# EAGLE design OPEnS-RTC-1.0 (EAGLE 9.4.2)

## Sheet 1 of 3
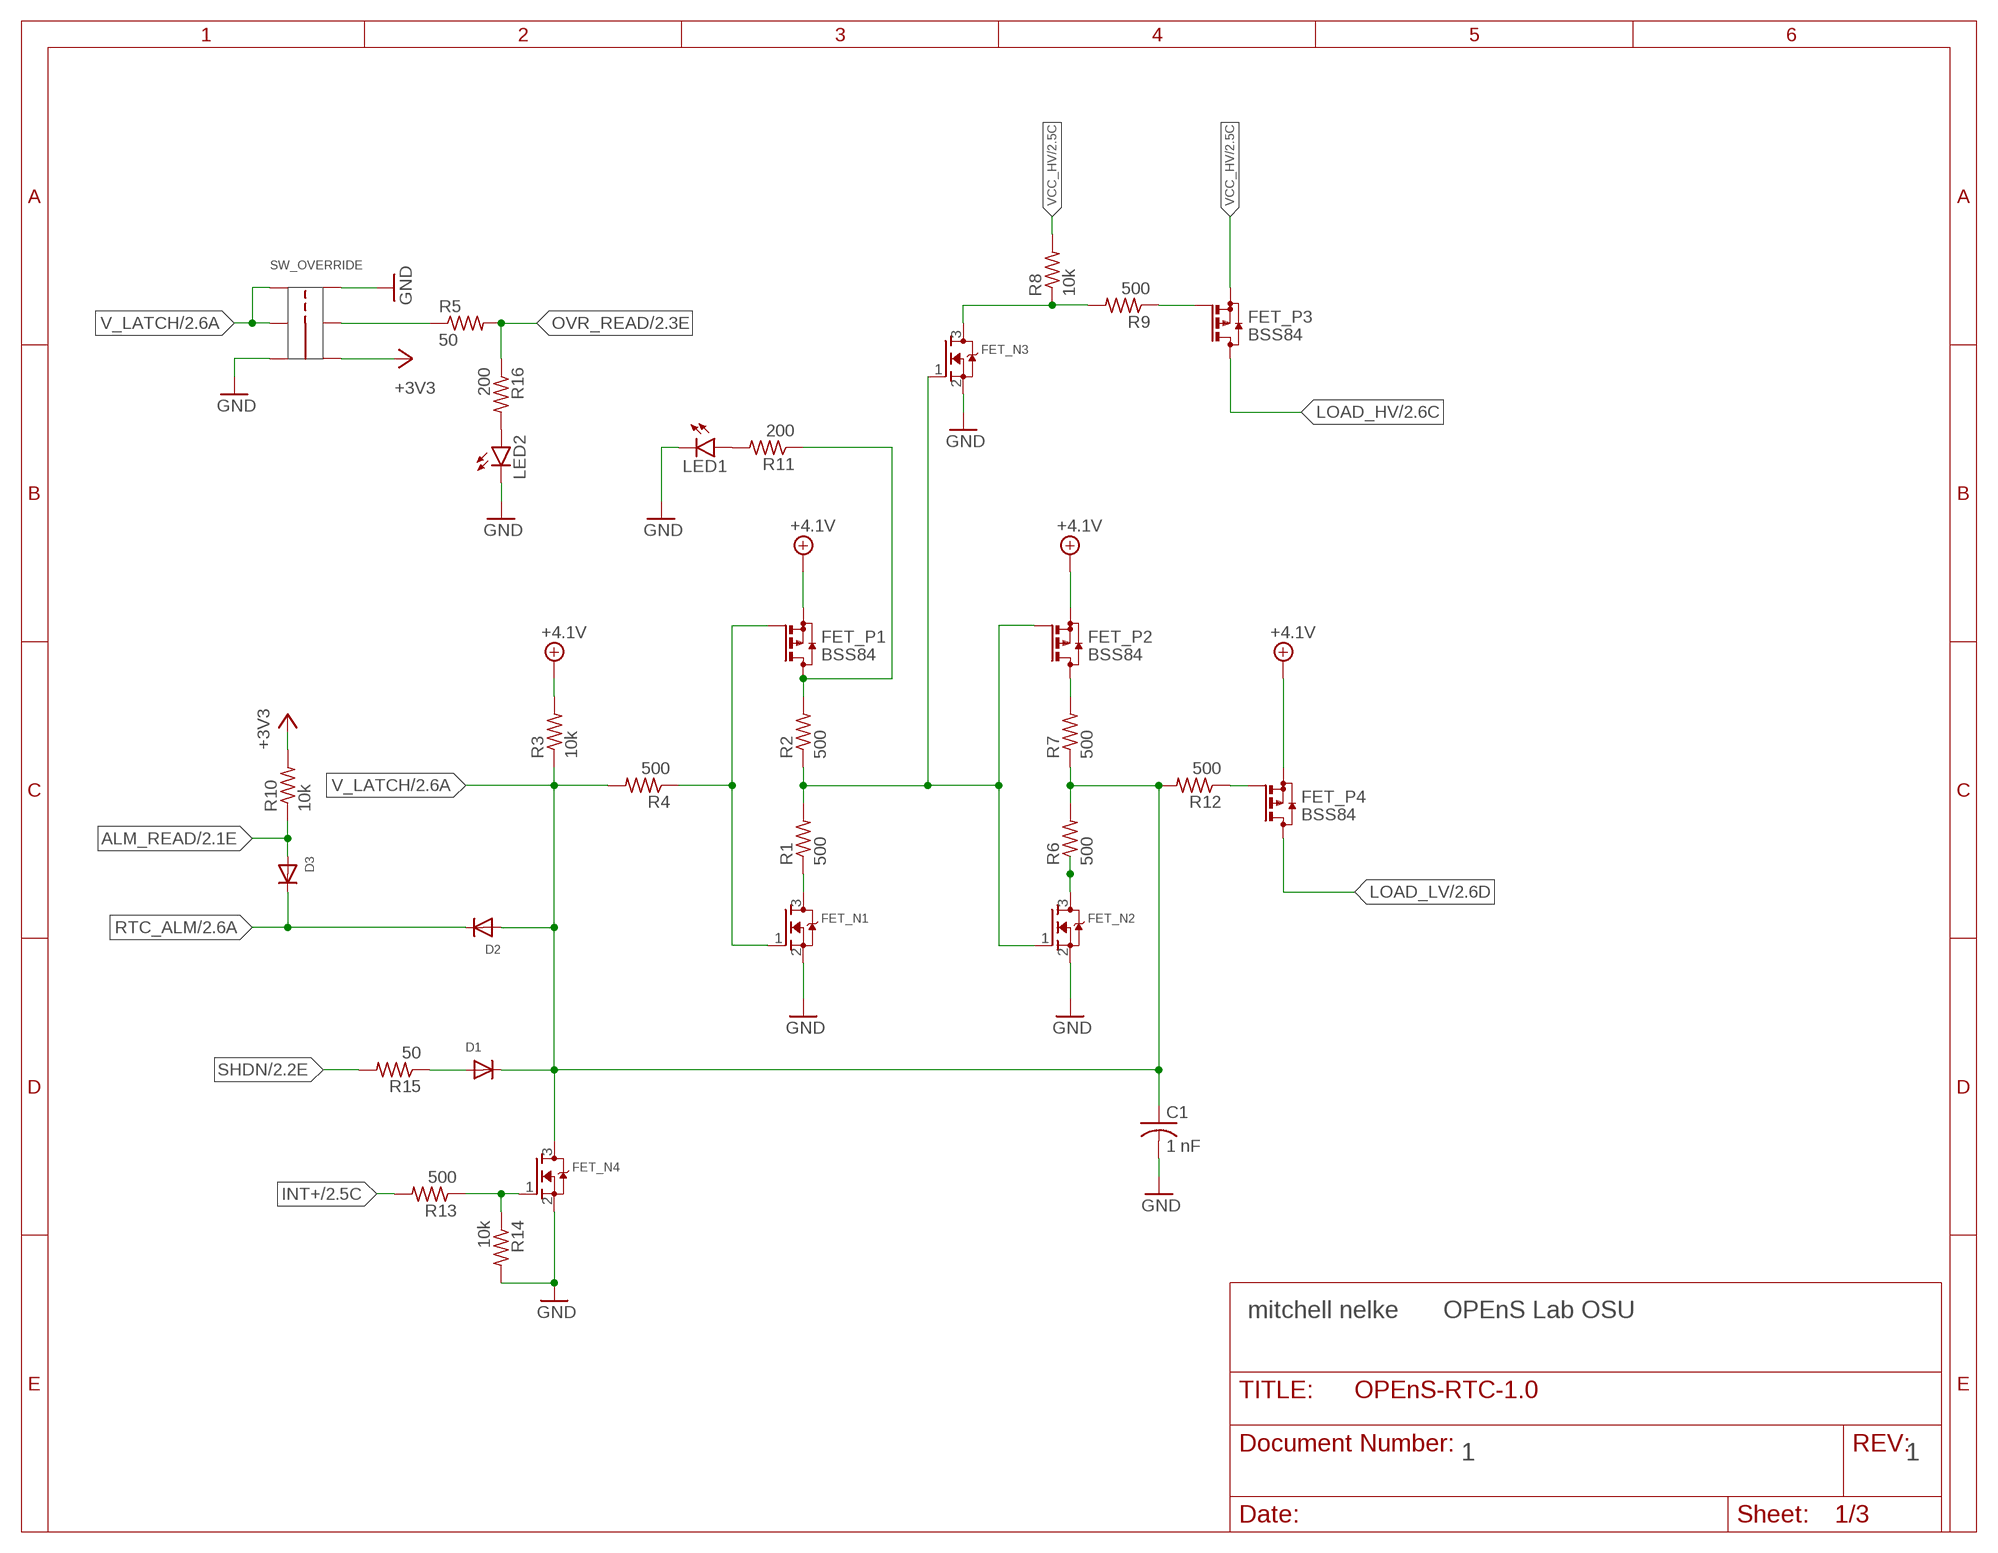
[diagram p0: schematic, sheet 1]

### Parts
C1  1 nF  C-USC0805  [C0805]
D1  DIODESOD-123  [SOD-123]
D2  DIODESOD-123  [SOD-123]
D3  DIODESOD-123  [SOD-123]
FET_N1  MOSFET-NREFLOW  [SOT23]
FET_N2  MOSFET-NREFLOW  [SOT23]
FET_N3  MOSFET-NREFLOW  [SOT23]
FET_N4  MOSFET-NREFLOW  [SOT23]
FET_P1  BSS84  [SOT23]
FET_P2  BSS84  [SOT23]
FET_P3  BSS84  [SOT23]
FET_P4  BSS84  [SOT23]
LED1  LEDSMT1206  [1206]
LED2  LEDSMT1206  [1206]
R1  500  R-US_R0805  [R0805]
R2  500  R-US_R0805  [R0805]
R3  10k  R-US_R0805  [R0805]
R4  500  R-US_R0805  [R0805]
R5  50  R-US_R0805  [R0805]
R6  500  R-US_R0805  [R0805]
R7  500  R-US_R0805  [R0805]
R8  10k  R-US_R0805  [R0805]
R9  500  R-US_R0805  [R0805]
R10  10k  R-US_R0805  [R0805]
R11  200  R-US_R0805  [R0805]
R12  500  R-US_R0805  [R0805]
R13  500  R-US_R0805  [R0805]
R14  10k  R-US_R0805  [R0805]
R15  50  R-US_R0805  [R0805]
R16  200  R-US_R0805  [R0805]
SW_OVERRIDE  JS202011JCQN  [VERTICAL_MNT_SMT-J]

### Nets
+3V3: R10.2 SW_OVERRIDE.A_ ; also sheet 2
+4.1V: FET_P1.2(S) FET_P2.2(S) FET_P4.2(S) R3.2 ; also sheet 2
ALM_READ: D3.A R10.1 ; also sheet 2
GND: C1.2 FET_N1.2(S) FET_N2.2(S) FET_N3.2(S) FET_N4.2(S) LED1.C LED2.C R14.2 SW_OVERRIDE.A SW_OVERRIDE.B_ ; also sheet 2
INT+: R13.2 ; also sheet 2
LOAD_HV: FET_P3.3(D) ; also sheet 2
LOAD_LV: FET_P4.3(D) ; also sheet 2
N$1: FET_P1.3(D) R2.2 R11.1
N$2: FET_N1.3(D) R1.1
N$3: FET_N1.1(G) FET_P1.1(G) R4.1
N$4: FET_N2.1(G) FET_N3.1(G) FET_P2.1(G) R1.2 R2.1
N$5: FET_N3.3(D) R8.1 R9.2
N$6: FET_P2.3(D) R7.2
N$7: FET_N2.3(D) R6.1
N$8: FET_P3.1(G) R9.1
N$9: LED1.A R11.2
N$10: FET_P4.1(G) R12.1
N$11: D1.A R15.1
N$12: FET_N4.1(G) R13.1 R14.1
N$13: LED2.A R16.2
N$16: R5.1 SW_OVERRIDE.COM_
OVR_READ: R5.2 R16.1 ; also sheet 2
RTC_ALM: D2.C D3.C ; also sheet 2
SHDN: R15.2 ; also sheet 2
V_LATCH: C1.1 D1.C D2.A FET_N4.3(D) R3.1 R4.2 R6.2 R7.1 R12.2 SW_OVERRIDE.B SW_OVERRIDE.COM ; also sheet 2
VCC_HV: FET_P3.2(S) R8.2 ; also sheet 2

### Notes on the sheet
- mitchell nelke | OPEnS Lab OSU
- 1 | 1

## Sheet 2 of 3
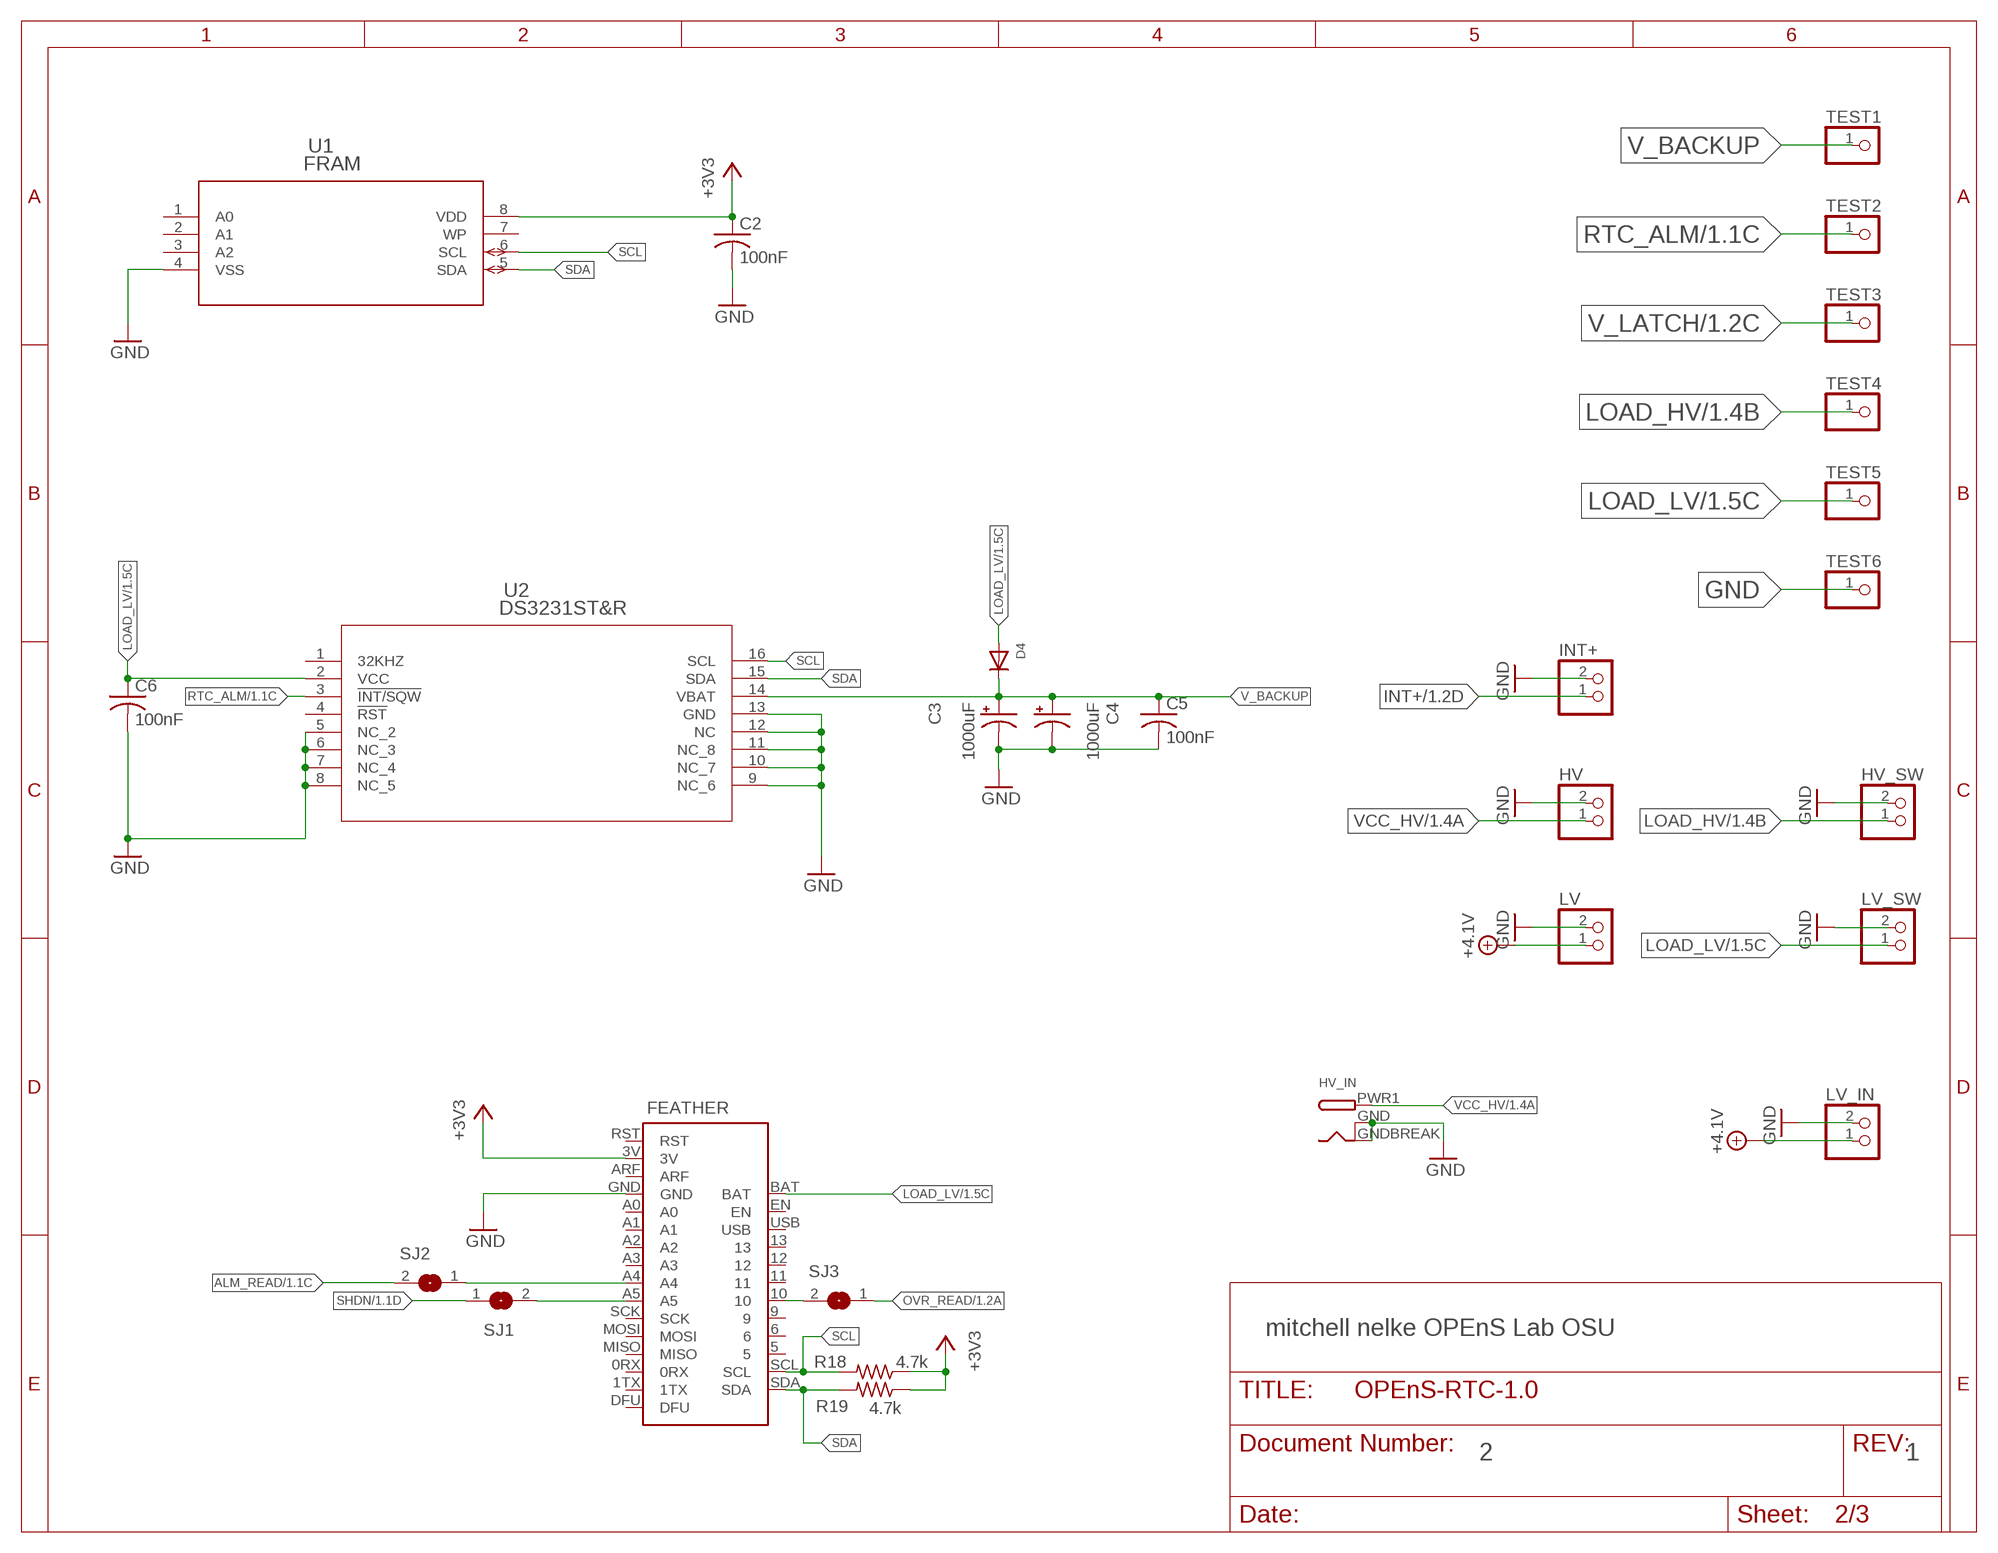
[diagram p1: schematic, sheet 2]

### Parts
C2  100nF  C-USC0805  [C0805]
C3  1000uF  CPOL-USE3.5-8  [E3,5-8]
C4  1000uF  CPOL-USE3.5-8  [E3,5-8]
C5  100nF  C-USC0805  [C0805]
C6  100nF  C-USC0805  [C0805]
D4  DIODESOD-123  [SOD-123]
FEATHER  BLUEFRUIT_M0  [BLUEFRUIT_MO]
HV  JST_2PIN-SMT  [JST-PH-2-SMT]
HV_IN  DCBARRELSMT  [DCJACK_2MM_SMT]
HV_SW  JST_2PIN-SMT  [JST-PH-2-SMT]
INT+  JST_2PIN-SMT  [JST-PH-2-SMT]
LV  JST_2PIN-SMT  [JST-PH-2-SMT]
LV_IN  JST_2PIN-SMT  [JST-PH-2-SMT]
LV_SW  JST_2PIN-SMT  [JST-PH-2-SMT]
R18  4.7k  R-US_M0805  [M0805]
R19  4.7k  R-US_M0805  [M0805]
SJ1  SJ  [SJ]
SJ2  SJ  [SJ]
SJ3  SJ  [SJ]
TEST1  PINHD-1X1  [1X01]
TEST2  PINHD-1X1  [1X01]
TEST3  PINHD-1X1  [1X01]
TEST4  PINHD-1X1  [1X01]
TEST5  PINHD-1X1  [1X01]
TEST6  PINHD-1X1  [1X01]
U1  FRAM  [FPT-8P-M02]
U2  DS3231ST&R  [21-0042B_16]

### Nets
+3V3: C2.1 FEATHER.3V R18.1 R19.1 U1.8(VDD) ; also sheet 1
+4.1V: LV.1 LV_IN.1 ; also sheet 1
ALM_READ: SJ2.2 ; also sheet 1
GND: C2.2 C3.- C4.- C5.2 C6.2 FEATHER.GND HV.2 HV_IN.GND(GNDBREAK) HV_IN.GNDBREAK(GND) HV_SW.2 INT+.2 LV.2 LV_IN.2 LV_SW.2 TEST6.1 U1.4(VSS) U2.5(NC_2) U2.6(NC_3) U2.7(NC_4) U2.8(NC_5) U2.9(NC_6) U2.10(NC_7) U2.11(NC_8) U2.12(NC) U2.13(GND) ; also sheet 1
INT+: INT+.1 ; also sheet 1
LOAD_HV: HV_SW.1 TEST4.1 ; also sheet 1
LOAD_LV: C6.1 D4.A FEATHER.BAT LV_SW.1 TEST5.1 U2.2(VCC) ; also sheet 1
N$14: FEATHER.A4 SJ2.1
N$15: FEATHER.A5 SJ1.2
N$20: FEATHER.10 SJ3.2
OVR_READ: SJ3.1 ; also sheet 1
RTC_ALM: TEST2.1 U2.3(!INT/SQW) ; also sheet 1
SCL: FEATHER.SCL R18.2 U1.6(SCL) U2.16(SCL)
SDA: FEATHER.SDA R19.2 U1.5(SDA) U2.15(SDA)
SHDN: SJ1.1 ; also sheet 1
V_BACKUP: C3.+ C4.+ C5.1 D4.C TEST1.1 U2.14(VBAT)
V_LATCH: TEST3.1 ; also sheet 1
VCC_HV: HV.1 HV_IN.PWR1(PWR) ; also sheet 1
Unconnected: FEATHER.0RX FEATHER.1TX FEATHER.5 FEATHER.6 FEATHER.9 FEATHER.11 FEATHER.12 FEATHER.13 FEATHER.A0 FEATHER.A1 FEATHER.A2 FEATHER.A3 FEATHER.ARF FEATHER.DFU FEATHER.EN FEATHER.MISO FEATHER.MOSI FEATHER.RST FEATHER.SCK FEATHER.USB U1.1(A0) U1.2(A1) U1.3(A2) U1.7(WP) U2.1(32KHZ) U2.4(!RST)

### Notes on the sheet
- mitchell nelke OPEnS Lab OSU
- 2 | 1

## Sheet 3 of 3

## Library data of the parts
C1 = rcl:C-US: CAPACITOR, American symbol; SPICEPREFIX: C
C2 C5 C6 = adafruit:C-US: CAPACITOR, American symbol
C3 C4 = adafruit:CPOL-US: POLARIZED CAPACITOR, American symbol
D1-D4 = adafruit:DIODE: Diode SMADIODE - SMA Surface Mount Package 20V 1A Schottky Diode Digikey: 641-1014-6-ND DO-1N4148 - Through Hole Small Current Diode SOD-123 20V 1 A (.5mV Vf) Schottky Diode - Digikey: MBRX120TPMSCT-ND SOD-323 10V 570mA (.38mV Vf, 3ns) Schottky Diode - Digikey: ZLLS410CT-ND SOD-523 30V 30mA Schottky Diode (RB751S-40TE61) - Digikey: RB751S-40TE61CT-ND SOT23-R/W - SOT23 Package (R = Solder Paste/Reflow Ovens, W = Hand-Soldering) BAT54Film 40V 300mA - Digikey: 497-7162-1-ND
FEATHER = bluefruit_m0:BLUEFRUIT_M0: Adafruit's M0 Bluefruit / Bluetooth board layout
FET_N1-FET_N4 = adafruit:MOSFET-N: N-Channel Mosfet 2N7002E - 60V 260mA SOT23 [Digikey: 2N7002ET1GOSTR-ND] - REEL BSH103 - 30V 850mA SOT23 [Digikey: 568-5013-1-ND]
FET_P1-FET_P4 = transistor-small-signal:BSS84: P-CHANNEL MOS FET
HV HV_SW INT+ LV LV_IN LV_SW = adafruit:JST_2PIN: JST 2-Pin Connectors of various flavors SMT-RA (S2B-PH-SM4) 4UConnector #17311 SMT (B2B-PH-SM4) THM-RA (S2B-PH) THM (B2B-PH)
HV_IN = adafruit:DCBARREL: 2.0mm DC Barrel Jack DCJACK_2MM_PTH - Through Hole Jack (4UConnector: 05537)
LED1 LED2 = led:LED: LED OSRAM: - CHIPLED LG R971, LG N971, LY N971, LG Q971, LY Q971, LO R971, LY R971 LH N974, LH R974 LS Q976, LO Q976, LY Q976 LO Q996 - Hyper CHIPLED LW Q18S LB Q993, LB Q99A, LB R99A - SideLED LS A670, LO A670, LY A670, LG A670, LP A670 LB A673, LV A673, LT A673, LW A673 LH A674 LY A675 LS A676, LA A676, LO A676, LY A676, LW A676 LS A679, LY A679, LG A679 - Hyper Micro SIDELED® LS Y876, LA Y876, LO Y876, LY Y876 LT Y87S - SmartLED LW L88C, LW L88S LB L89C, LB L89S, LG L890 LS L89K, LO L89K, LY L89K LS L896, LA L896, LO L896, LY L896 - TOPLED LS T670, LO T670, LY T670, LG T670, LP T670 LSG T670, LSP T670, LSY T670, LOP T670, LYG T670 LG T671, LOG T671, LSG T671 LB T673, LV T673, LT T673, LW T673 LH T674 LS T676, LA T676, LO T676, LY T676, LB T676, LH T676, LSB T676, LW T676 LB T67C, LV T67C, LT T67C, LS T67K, LO T67K, LY T67K, LW E67C LS E67B, LA E67B, LO E67B, LY E67B, LB E67C, LV E67C, LT E67C LW T67C LS T679, LY T679, LG T679 LS T770, LO T770, LY T770, LG T770, LP T770 LB T773, LV T773, LT T773, LW T773 LH T774 LS E675, LA E675, LY E675, LS T675 LS T776, LA T776, LO T776, LY T776, LB T776 LHGB T686 LT T68C, LB T68C - Hyper Mini TOPLED® LB M676 - Mini TOPLED Santana® LG M470 LS M47K, LO M47K, LY M47K Source: http://www.osram.convergy.de LUXEON: - LUMILED® LXK2-PW12-R00, LXK2-PW12-S00, LXK2-PW14-U00, LXK2-PW14-V00 LXK2-PM12-R00, LXK2-PM12-S00, LXK2-PM14-U00 LXK2-PE12-Q00, LXK2-PE12-R00, LXK2-PE12-S00, LXK2-PE14-T00, LXK2-PE14-U00 LXK2-PB12-K00, LXK2-PB12-L00, LXK2-PB12-M00, LXK2-PB14-N00, LXK2-PB14-P00, LXK2-PB14-Q00 LXK2-PR12-L00, LXK2-PR12-M00, LXK2-PR14-Q00, LXK2-PR14-R00 LXK2-PD12-Q00, LXK2-PD12-R00, LXK2-PD12-S00 LXK2-PH12-R00, LXK2-PH12-S00 LXK2-PL12-P00, LXK2-PL12-Q00, LXK2-PL12-R00 Source: www.luxeon.com KINGBRIGHT: KA-3528ASYC Source: www.kingbright.com
R1-R16 = rcl:R-US_: RESISTOR, American symbol; SPICEPREFIX: R
R18 R19 = adafruit:R-US_: RESISTOR, American symbol
SJ1-SJ3 = jumper:SJ: SMD solder JUMPER
SW_OVERRIDE = power8:JS202011JCQN: 2 position 3x2 pin switch, two row, JS202011JCQN, SMD
TEST1-TEST6 = pinhead:PINHD-1X1: PIN HEADER
U1 = power8:FRAM: MB85RC128APNF-G-JNE1, FRAM 128k, 128kb, I2C; MANUFACTURER_PART_NUMBER: Inc.; VENDOR: Fujitsu Semiconductor
U2 = power8:DS3231ST&R: DS3231 RTC IC only; MANUFACTURER_PART_NUMBER: DS3231S#T&R; VENDOR: Maxim Integrated Products

## Board
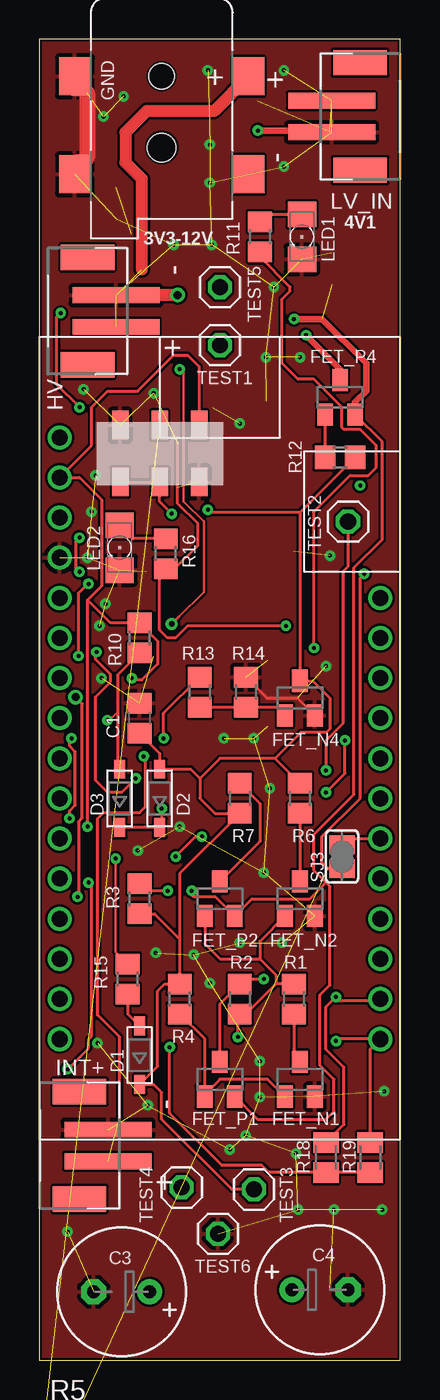
[diagram p2: board, top side]
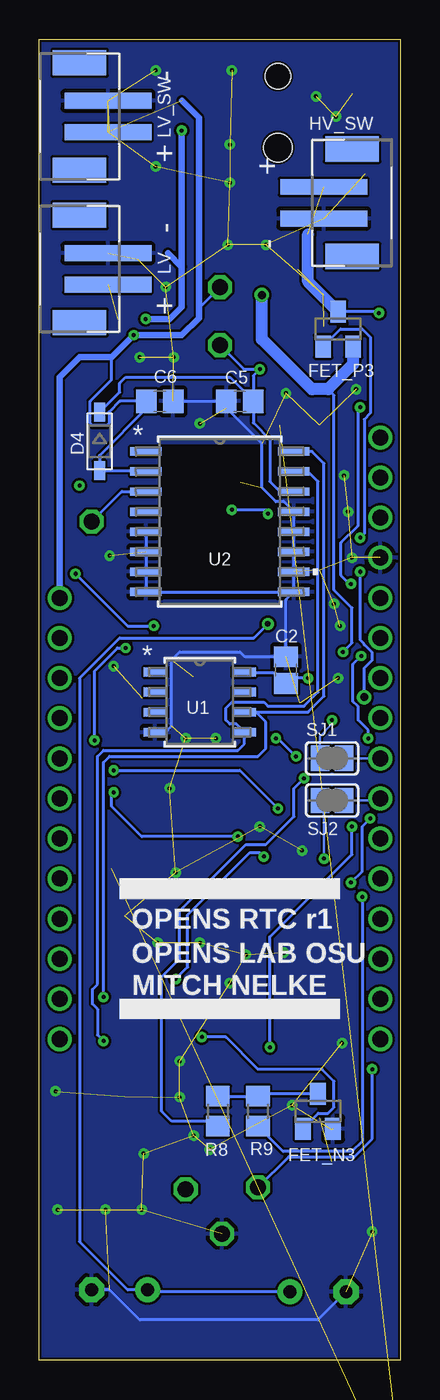
[diagram p3: board, bottom side, seen from below]

Size 22.86 x 83.62 mm. Coordinates in mm from the lower left corner, seen from the top.
Outline: 0,0 22.86,0 22.86,83.62 0,83.62 0,0
Copper layers (1*16): Top 0.035mm / dielectric 1.5mm / Bottom 0.035mm
Design rules "default *": minimum track width 6mil, minimum drill 10mil, track to track 6mil, track to pad 6mil, pad to pad 6mil, via to via 6mil, smd to smd 6mil, copper to edge 6mil, drill to drill 6mil, minimum pad ring 10mil, minimum via ring 8mil, stop-mask expansion 4mil, vias tented up to drill 11mil, thermal gap 10mil
bRestrict: area 7.6,48.3 to 15.2,57.9

### Footprints (pad centres in the part's own frame; a part is rotated, then mirrored left to right if it is on the bottom)
C0805 = smd 1.3 x 1.5: 1 -0.95,0; 2 0.95,0
C0805' = smd 1.3 x 1.5: 1 -0.85,0; 2 0.85,0
E3,5-8 = drill 0.813 pad 1.6: + -1.778,0 | drill 0.813 pad 1.6 octagon: - 1.778,0
SOD-123 = smd 1.2 x 0.7: A 1.85,0; C -1.85,0
BLUEFRUIT_MO = drill 1.016: 0RX 39.37,1.27; 1TX 41.91,1.27; 3V 8.89,1.27; 5 39.37,21.59; 6 36.83,21.59; 9 34.29,21.59; 10 31.75,21.59; 11 29.21,21.59; 12 26.67,21.59; 13 24.13,21.59; A0 16.51,1.27; A1 19.05,1.27; A2 21.59,1.27; A3 24.13,1.27; A4 26.67,1.27; A5 29.21,1.27; ARF 11.43,1.27; BAT 16.51,21.59; DFU 44.45,1.27; EN 19.05,21.59; GND 13.97,1.27; MISO 36.83,1.27; MOSI 34.29,1.27; RST 6.35,1.27; SCK 31.75,1.27; SCL 41.91,21.59; SDA 44.45,21.59; USB 21.59,21.59
SOT23 = smd 1 x 1.4: 1 -0.95,-1.1; 2 0.95,-1.1; 3 0,1.1
JST-PH-2-SMT = smd 1 x 5.5: 1 -1,-1.8; 2 1,-1.8 | smd 1.6 x 3.4: NC1 -3.4,0; NC2 3.4,0
DCJACK_2MM_SMT = smd 2.4 x 2: GND 0,-5.5; GNDBREAK 6.2,-5.5; PWR1 0,5.5; PWR2 6.2,5.5 | hole 1.6: 0,0 | hole 1.8: 4.5,0
1206 = smd 1.6 x 1.803: A -1.422,0; C 1.422,0
R0805 = smd 1.3 x 1.5: 1 -0.95,0; 2 0.95,0
M0805 = smd 1.3 x 1.6: 1 -0.95,0; 2 0.95,0
SJ = smd 1.168 x 1.6: 1 -0.762,0; 2 0.762,0
VERTICAL_MNT_SMT-J = smd 1.05 x 1.8: A -2.5,1.8; A_ -2.5,-1.8; B 2.5,1.8; B_ 2.5,-1.8; COM 0,1.8; COM_ 0,-1.8
1X01 = drill 1.016 octagon: 1 0,0
FPT-8P-M02 = smd 1.473 x 0.559: 1 -2.819,1.905; 2 -2.819,0.635; 3 -2.819,-0.635; 4 -2.819,-1.905; 5 2.819,-1.905; 6 2.819,-0.635; 7 2.819,0.635; 8 2.819,1.905
21-0042B_16 = smd 1.981 x 0.533: 1 -4.686,4.445; 2 -4.686,3.175; 3 -4.686,1.905; 4 -4.686,0.635; 5 -4.686,-0.635; 6 -4.686,-1.905; 7 -4.686,-3.175; 8 -4.686,-4.445; 9 4.686,-4.445; 10 4.686,-3.175; 11 4.686,-1.905; 12 4.686,-0.635; 13 4.686,0.635; 14 4.686,1.905; 15 4.686,3.175; 16 4.686,4.445

### Placement (x,y rotation side)
C1  6.35,40.64 90 top
C2  100nF  [C0805']  7.24,43.69 90 bottom
C3  5.21,4.32 180 top
C4  17.78,4.45 0 top
C5  100nF  [C0805']  10.16,60.71 180 bottom
C6  100nF  [C0805']  15.24,60.71 0 bottom
D1  6.35,19.3 90 top
D2  7.62,35.56 90 top
D3  5.08,35.56 90 top
D4  19.05,58.17 270 bottom
FEATHER  0,64.77 270 top
FET_N1  16.51,17.78 0 top
FET_N2  16.51,29.21 0 top
FET_N3  5.21,15.75 0 bottom
FET_N4  16.51,41.91 0 top
FET_P1  11.43,17.78 0 top
FET_P2  11.43,29.21 0 top
FET_P3  3.94,65.28 0 bottom
FET_P4  19.05,60.96 0 top
HV  3.05,66.42 90 top
HV_IN  7.75,81.28 270 top
HV_SW  3.05,73.28 270 bottom
INT+  2.54,13.59 90 top
LED1  16.64,71.12 270 top
LED2  5.08,51.44 270 top
LV  20.32,69.09 90 bottom
LV_IN  20.32,78.74 270 top
LV_SW  20.32,78.74 90 bottom
R1  16.13,22.86 90 top
R2  12.7,22.86 90 top
R3  6.35,29.21 90 top
R4  8.89,22.86 90 top
R5  1.27,-3.81 0 top  (outside the outline)
R6  16.51,35.56 90 top
R7  12.7,35.56 90 top
R8  11.56,15.75 270 bottom
R9  9.02,15.75 90 bottom
R10  6.35,45.72 90 top
R11  13.97,71.12 90 top
R12  19.05,57.15 0 top
R13  10.16,42.29 90 top
R14  13.08,42.29 90 top
R15  5.59,24.13 90 top
R16  8,51.05 90 top
R18  18.16,12.83 90 top
R19  20.95,12.83 90 top
SJ1  4.32,35.43 0 bottom
SJ2  4.32,38.1 180 bottom
SJ3  19.18,31.88 90 top
SW_OVERRIDE  7.62,57.4 180 top
TEST1  11.43,64.26 0 top
TEST2  19.56,53.09 0 top
TEST3  13.59,10.79 0 top
TEST4  9.02,10.92 0 top
TEST5  11.43,67.95 0 top
TEST6  11.3,8 0 top
U1  12.7,41.66 0 bottom
U2  11.43,53.09 0 bottom

### Tracks (layer width: path | path; a pad name or v marks a point on that pad's centre or on a via)
+3V3  (via drill 0.25)
  Top 0.178: R19.1 R18.1 14.54,11.88 14.1,12.32 11.56,12.32 8.26,15.62 v8.26,19.81 | SW_OVERRIDE.A_ 10.12,62.91 9.4,63.63 8.51,63.63 6.22,61.34 4.32,61.34 3.3,60.33 3.3,57.91 FEATHER.3V 2.54,55.88 3.94,54.48 3.94,49.02 3.05,48.13 | v3.05,33.78 3.05,48.13 | v5.84,43.18 5.97,43.05 6.48,43.05 7.49,44.07 7.49,45.53 R10.2 4.51,46.67 3.05,48.13
  Bottom 0.178: 9.82,43.5 7.9,43.5 C2.1 6.9,43.18 v5.84,43.18 | v8.26,19.81 8.26,26.8 3.05,32 v3.05,33.78
  Bottom 0.254: 9.82,43.5 U1.8
+4.1V  (via drill 0.25)  (2 unrouted)
  Top 0.178: FET_P1.2 13.82,15.24 18.16,15.24 18.67,15.75 18.67,17.78 17.78,18.67 17.78,23.11 18.41,23.75 18.41,29.97 18.16,30.23 | FET_P4.2 21.72,58.14 21.72,51.94 19.94,50.16 19.94,35.81 17.4,33.27 17.4,30.99 18.16,30.23 | 18.16,30.23 17.14,29.21 13.48,29.21 FET_P2.2 11.15,29.34 9.78,29.34 9.65,29.46 v9.65,29.72 | v8.13,29.72 6.79,29.72 R3.2
  Top 0.406: FET_P4.2 20,60.64 20.7,61.34 20.7,63.12 17.91,65.91 v16.13,65.91 | v13.84,77.85 15.24,77.85 | 15.24,77.85 18.41,77.85 | 15.24,77.85
  Bottom 0.178: v9.65,29.72 v8.13,29.72
  Bottom 0.406: v16.13,65.91 14.61,65.91 13.84,66.67 13.84,69.22 | 13.84,69.22 14.72,70.09 | 13.84,69.22 v13.84,77.85
ALM_READ  (via drill 0.25)
  Top 0.152: v4.32,40.51 4.45,40.51 4.95,41.02 4.95,41.66
  Top 0.178: D3.A 4.95,37.54 4.95,41.66 4.95,43.37 R10.1
  Bottom 0.152: SJ2.2 5.08,39.5 4.32,40.26 v4.32,40.51
GND  (via drill 0.25)  (65 unrouted)
  Top 0.178: R14.2 14.41,41.91 16.36,41.91 FET_N4.2
  Top 1.016: HV_IN.GND 2.25,80.53 2.71,80.53 3.01,80.23 3.01,76.14 2.71,75.83 2.25,75.83 HV_IN.GNDBREAK
  Bottom 0.178: C6.2 C5.2 11.01,60.29 8.76,58.04 8.76,55.25 7.87,54.36 7.38,54.36 U2.13 U2.12 U2.11 U2.10 U2.9 | U1.4 14.86,39.75 14.48,40.13 14.48,44.32 13.97,44.83 10.16,44.83 9.87,44.54 C2.2 7.24,48.15 U2.9 | U2.5 U2.6 U2.7 U2.8 U2.9 | C3.- 5.21,2.54 16.51,2.54 18.41,4.45 C4.-
  other vias: 3.68,20.07 6.22,32.26 3.94,43.18 3.81,46.48 3.05,50.8 8.51,70.61 10.92,70.61 14.35,63.5 10.67,81.66 10.79,76.96 10.79,74.55 4.06,78.74 5.33,80.01 2.79,61.47 7.24,61.21 12.7,59.31 16.51,63.5 14.86,67.95 15.49,75.56 15.49,81.66 18.16,43.94 14.61,36.2 14.22,30.86 8.89,33.78 7.37,25.78 10.79,23.88 13.97,16.64 16.26,13.08 16.38,9.53 18.67,9.53 1.78,8.13 13.97,18.92 21.84,17.02 21.72,9.53 15.37,26.42 12.7,26.42 18.41,50.93 3.56,56.01 4.19,47.88 3.3,53.72 9.78,25.65 6.86,16.13 12.06,13.34 13.08,14.22 11.68,39.37 13.59,39.37
  pour Bottom (rank 2): 0,0 22.86,0 22.86,83.82 0,83.82 0,0.13
  pour Top: 0,0 22.86,0 22.86,83.69 0,83.69
GND18  (via drill 0.25)
  other vias: 20.32,55.37
INT+  (via drill 0.25)  (1 unrouted)
  Top 0.178: 5.08,15.33 5.08,20.45 3.68,21.84 3.68,34.29 4.06,34.67 6.35,34.67 6.73,35.05 6.73,38.1 v6.6,38.23 | v7.87,39.37 7.87,40.96 R13.2
  Bottom 0.178: v6.6,38.23 7.75,39.37 v7.87,39.37
LOAD_HV  (via drill 0.25)  (1 unrouted)
  Top 0.178: v1.78,18.41 3.11,19.75 3.11,20.3 3.3,20.49 3.3,30.23 v3.11,30.23 | v2.03,39.37 1.91,39.24 1.91,38.88 2.27,38.52 2.27,35.14 1.91,34.78 v1.91,34.29 | v2.48,44.58 2.48,48.58 3.05,49.15 v3.11,49.15 | v2.54,60.33 1.1,61.76 1.1,66.05 v1.35,66.29
  Bottom 0.178: TEST4.1 7.06,12.88 2.91,12.88 1.78,14.01 v1.78,18.41 | v3.11,30.23 2.41,30.92 2.41,33.78 v1.91,34.29 | v2.03,39.37 2.03,39.88 2.67,40.51 2.67,41.37 2.98,41.68 2.98,44.07 v2.48,44.58 | v3.11,49.15 3.22,49.15 3.75,49.67 3.75,51.75 2.67,52.83 2.67,60.2 v2.54,60.33 | v1.35,66.29 1.43,66.38 FET_P3.3
  Bottom 0.762: FET_P3.3 5.84,68.28 5.84,71.28
LOAD_LV  (via drill 0.25)  (1 unrouted)
  Top 0.178: 19.05,62.74 FET_P4.3
  Top 0.406: v16.89,64.9 19.05,62.74
  Bottom 0.178: U2.2 16.17,56.32 D4.A 19.05,57.28 16.09,60.24 C6.1 17.78,60.71 18.46,60.03 18.46,59.32 18.6,59.18 19.5,59.18 19.64,59.32 19.64,60.72 18.29,62.07 18.29,63.5 | TEST5.1 12.76,66.61 12.76,65.98
  Bottom 0.406: 13.83,79.74 12.76,78.68 12.76,65.98 13.84,64.9 v16.89,64.9 18.29,63.5 20.32,63.5 21.59,62.23 FEATHER.BAT
N$1  (via drill 0.25)
  Top 0.178: FET_P1.3 11.43,22.54 R2.2 13.02,24.13 v14.22,24.13 | v8.64,31.88 9.91,33.15 v10.29,33.15 | v18.16,35.94 19.37,37.15 v19.37,39.24 | v17.4,45.09 17.4,53.72 19.68,56.01 20.83,56.01 21.34,56.52 21.34,57.91 20.33,58.92 19.4,58.92 19.39,58.93 19.3,58.93 19.18,59.05 19.18,60.33 17.4,62.1 16.38,62.1 15.37,63.12 15.37,67.18 15.88,67.69 15.88,67.95 13.97,69.85 R11.1
  Bottom 0.178: v14.22,24.13 13.46,24.89 13.46,28.19 9.53,32.13 8.89,32.13 v8.64,31.88 | v10.29,33.15 16.38,33.15 18.29,35.05 18.29,35.81 v18.16,35.94 | v19.37,39.24 19.37,43.62 17.91,45.09 v17.4,45.09
N$2
  Top 0.178: R1.1 16.13,19.26 FET_N1.3
N$3
  Top 0.178: R4.1 10.48,20.32 FET_P1.1 10.48,16.83 11.43,17.78 14.46,17.78 FET_N1.1
N$4  (via drill 0.25)
  Top 0.178: R1.2 14.98,23.81 | 14.98,23.81 13.08,21.91 R2.1 12.57,21.78 v12.57,20.45 | FET_P2.1 10.48,26.35 11.43,25.4 13.97,25.4 | 13.97,25.4 14.98,24.39 14.98,23.81 | FET_N2.1 13.97,26.52 13.97,25.4
  Bottom 0.178: FET_N3.1 5.18,15.62 4.57,15.62 4.19,16 4.19,17.65 4.95,18.41 9.02,18.41 11.05,20.45 v12.57,20.45
N$5
  Bottom 0.178: FET_N3.3 8.87,16.85 R9.2 R8.1
N$6
  Top 0.178: R7.2 13.97,35.24 13.97,32.85 FET_P2.3
N$7
  Top 0.178: R6.1 FET_N2.3
N$8  (via drill 0.25, 0.51)
  Top 0.178: v2.41,29.34 2.48,29.4 2.48,34.1 2.72,34.34 2.72,41.54 v2.29,41.97 | v2.54,52.07 2.29,51.82 2.29,50.16 v2.54,49.91
  Bottom 0.178: FET_P3.1 3.79,65.28 2.41,65.28 1.91,64.77 1.91,59.94 2.29,59.56 2.29,52.32 v2.54,52.07 | v2.41,29.34 2.41,13.84 3.05,13.21 7.43,13.21 R9.1 | v2.29,41.97 2.29,43.82 1.78,44.32 1.78,44.81 2.27,45.3 2.27,45.33 2.54,45.59 v2.54,49.91
N$9
  Top 0.178: R11.2 14.44,72.54 LED1.A
N$10
  Top 0.203: FET_P4.1 R12.1
N$11
  Top 0.178: R15.1 5.59,21.92 D1.A
N$12
  Top 0.178: R13.1 R14.1 15.03,41.34 FET_N4.1
N$13
  Top 0.203: R16.2 5.93,52 LED2.A
N$14
  Bottom 0.152: SJ2.1 FEATHER.A4
N$15
  Bottom 0.152: SJ1.2 1.4,35.43 FEATHER.A5
N$16  (1 unrouted)
N$20
  Top 0.178: SJ3.2 19.56,33.02 FEATHER.10
OVR_READ  (via drill 0.25)  (1 unrouted)
  Top 0.178: 8.57,50.1 10.03,51.56 10.03,52.96 8.76,54.23 8.76,58.06 | v20.57,49.78 20.32,49.53 20.32,35.56 17.91,33.15 17.91,31.5 18.29,31.11 SJ3.1 | v15.62,46.48 9.4,46.48 8.64,45.72 8.13,45.72 7.62,46.23 7.62,49.72 R16.1
  Top 0.203: R16.1 8.57,50.1
  Bottom 0.178: v20.57,49.78 17.27,46.48 v15.62,46.48
RTC_ALM  (via drill 0.25)
  Top 0.178: D3.C D2.C 7.75,33.84 v7.75,34.92 | TEST2.1 19.56,50.25 19.23,49.92 19.23,40.31 18.16,39.24 v18.16,37.34
  Bottom 0.178: TEST2.1 17.65,54.99 U2.3 | v18.16,37.34 10.16,37.34 v7.75,34.92
SCL  (via drill 0.25)
  Top 0.178: FEATHER.SCL 21.46,22.73 19.05,22.73 v18.8,22.99 18.16,22.35 18.16,19.68 19.3,18.54 19.3,14.92 R18.2
  Bottom 0.178: U2.16 5.59,57.53 4.83,56.77 4.83,42.04 5.84,41.02 U1.6 9.14,41.02 8.51,40.39 8.51,38.73 9.02,38.23 18.41,38.23 18.8,37.85 v18.8,22.99
SDA  (via drill 0.25)
  Top 0.178: v18.8,20.19 18.92,20.32 FEATHER.SDA 20.95,19.68 R19.2
  Bottom 0.178: U2.15 5.84,56.26 5.21,55.63 5.21,42.29 6.1,41.4 8.38,41.4 8.64,41.66 10.67,41.66 11.05,41.28 11.05,40.51 10.79,40.26 10.39,40.26 U1.5 9.88,39.01 10.29,38.61 18.8,38.61 19.18,38.23 19.18,23.79 19.49,23.48 19.49,22.54 19.18,22.22 19.18,20.57 v18.8,20.19
SHDN  (via drill 0.25)
  Top 0.152: v4.83,31.75 4.83,25.84 R15.2
  Bottom 0.152: SJ1.1 4.83,35.18 v4.83,31.75
V_BACKUP  (via drill 0.25, 0.35)
  Top 0.152: 8.83,47.05 10.41,48.64 10.41,53.09 9.14,54.36 9.14,62.48
  Top 0.178: v8.38,46.61 8.83,47.05 | 9.14,62.48 v8.89,62.74
  Bottom 0.178: D4.C 17.78,61.29 17.78,61.85 17.4,62.23 10.79,62.23 9.31,60.75 | 9.31,60.75 C5.1 9.31,59.35 8.26,58.29 8.26,55.63 7.62,54.99 U2.14 | C3.+ 15.88,4.32 C4.+ 17.27,4.45 20.32,7.49 20.32,43.18 17.78,45.72 9.27,45.72 v8.38,46.61 | 9.31,60.75 9.31,62.32 v8.89,62.74 9.91,62.74 TEST1.1
V_LATCH  (via drill 0.25)
  Top 0.178: 8.89,26.67 8.89,30.8 R7.1 11.11,34.61 10.16,35.56 10.16,36.83 | 8.89,26.67 R4.2 7.93,23.81 7.49,23.37 7.49,18.6 D1.C 7.24,17.45 7.75,16.95 7.75,15.24 12.19,10.79 TEST3.1 | R6.2 14.92,38.1 | 14.92,38.1 11.43,38.1 10.16,36.83 | 10.16,36.83 9.58,37.41 D2.A 7.62,38.42 C1.1 | R3.1 7.3,28.26 8.89,26.67 | FET_N4.3 17.32,43.01 18.41,41.91 18.41,39.97 18.19,39.74 16.56,39.74 14.92,38.1 | 16.51,53.66 10.67,53.66 v10.67,53.85 | v8.38,53.59 7.62,54.36 SW_OVERRIDE.COM SW_OVERRIDE.B
  Top 0.203: R12.2 16.51,53.66 FET_N4.3
  Bottom 0.178: v10.67,53.85 8.38,53.85 v8.38,53.59
VCC_HV  (via drill 0.25, 0.51)  (2 unrouted)
  Top 0.178: v6.1,36.83 5.21,35.94 4.32,35.94 3.56,36.7 3.56,41.99 4.51,42.94 4.51,43.42 3.56,44.37 3.56,44.77 v3.62,44.83
  Top 0.762: HV_IN.PWR1 11.05,79.08 6.8,79.08 5.45,77.73 5.45,75.83 6.48,74.8 6.48,69.05 | v8.76,67.44 4.86,67.44
  Bottom 0.178: R8.2 11.87,15.11 14.48,15.11 15.11,15.75 15.11,24.26 13.97,25.4 13.97,28.45 9.78,32.64 8.51,32.64 6.73,34.42 6.73,36.2 v6.1,36.83 | v3.62,44.83 3.05,45.4 3.05,47.62 4.19,48.77 4.19,61.09 4.57,61.47
  Bottom 0.762: FET_P3.2 2.99,63.05 4.57,61.47 5.59,61.47 8.76,64.64 v8.76,67.44

### Text on the board
tPlace: 4V1 | 3V3-12V
bPlace: OPENS RTC r1 | OPENS LAB OSU | MITCH NELKE